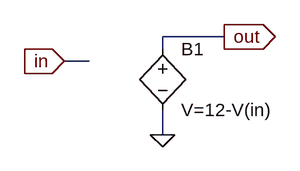
[diagram p0: schematic inverting.asc]
inverting.asc, the LTspice schematic file:
Version 4
SHEET 1 880 680
WIRE 272 128 192 128
WIRE 192 144 192 128
WIRE 96 160 64 160
WIRE 192 256 192 224
FLAG 192 256 0
FLAG 64 160 in
IOPIN 64 160 In
FLAG 272 128 out
IOPIN 272 128 Out
SYMBOL bv 192 128 R0
SYMATTR InstName B1
SYMATTR Value V=12-V(in)

The netlist it stands for:
* inverting.asc
B1 out 0 V=12-V(in)
.backanno
.end